# EAGLE design TeensyLinduinoShield (EAGLE 7.7.0)
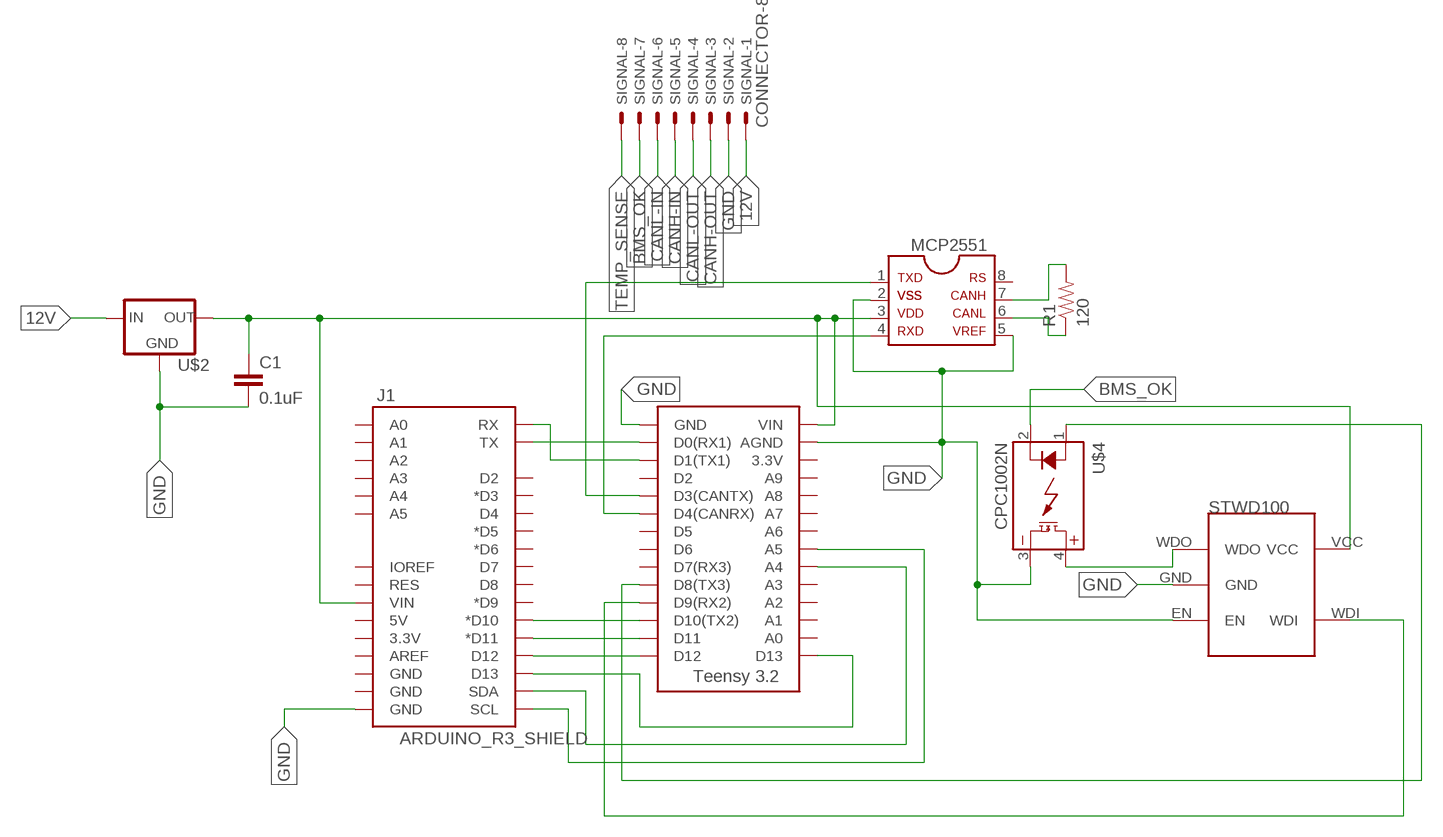
[diagram p0: schematic, sheet 1]

## Parts
C1  0.1uF  CAP0805  [0805]
J1  ARDUINO_R3_SHIELD  [UNO_R3_SHIELD]
MCP2551  MCP2551  [SOIC-08]
R1  120  RESISTOR0805-RES  [0805]
SIGNAL  CONNECTOR-8  [MINIFIT_5566-8]
U$1  TEENSY_3.2_SIMPLE  [TEENSY_3.2_SIMPLE]
U$2  5VREG_LM340-NLM340MPX-5.0/NOPB  [SOT223]
U$3  STWD100  [SOT23-5]
U$4  CPC1002N  [SOP04]

## Nets
12V: SIGNAL.1 U$2.1(IN)
BMS_OK: SIGNAL.7 U$4.2(CONTROL-)
CANH-IN: SIGNAL.5
CANH-OUT: SIGNAL.3
CANL: MCP2551.6 R1.1
CANL-IN: SIGNAL.6
CANL-OUT: SIGNAL.4
GND: C1.2 J1.GND@0(GND) MCP2551.2 MCP2551.5 SIGNAL.2 U$1.AGND U$1.GND U$2.2(GND) U$2.4(GND) U$3.EN U$3.GND U$4.3(DC-)
N$1: J1.TX U$1.D0(RX1)
N$2: J1.RX U$1.D1(TX1)
N$3: J1.D10(*D10) U$1.D10(TX2)
N$4: J1.D11(*D11) U$1.D11
N$5: C1.1 J1.VIN MCP2551.3 U$1.VIN U$2.3(OUT) U$3.VCC
N$6: J1.D12 U$1.D12
N$7: J1.D13 U$1.D13
N$8: MCP2551.1 U$1.D3(CANTX)
N$9: MCP2551.4 U$1.D4(CANRX)
N$10: J1.SCL U$1.A5
N$11: J1.SDA U$1.A4
N$12: U$1.D9(RX2) U$3.WDI
N$13: U$3.WDO U$4.4(DC+)
N$14: MCP2551.7 R1.2
N$16: U$1.D8(TX3) U$4.1(CONTROL+)
TEMP_SENSE: SIGNAL.8
Unconnected: J1.3.3V J1.5V J1.A0 J1.A1 J1.A2 J1.A3 J1.A4 J1.A5 J1.AREF J1.D2 J1.D3(*D3) J1.D4 J1.D5(*D5) J1.D6(*D6) J1.D7 J1.D8 J1.D9(*D9) J1.GND@1(GND) J1.GND@2(GND) J1.IOREF J1.RES MCP2551.8 U$1.3.3V U$1.A0 U$1.A1 U$1.A2 U$1.A3 U$1.A6 U$1.A7 U$1.A8 U$1.A9 U$1.D2 U$1.D5 U$1.D6 U$1.D7(RX3)

## Library data of the parts
C1 = HyTechDevices:CAP: Capacitor Standard 0603 ceramic capacitor, and 0.1" leaded capacitor.
J1 = HyTechDevices:ARDUINO_R3_SHIELD: Shield form compatible with the Arduino Uno R3. Source: Sparkfun <https://github.com/sparkfun/SparkFun-Eagle-Libraries>
MCP2551 = HyTechDevices:MCP2551: MCP2551 High-Speed CAN Transceiver Product Webpage <https://www.microchip.com/wwwproducts/en/MCP2551> Datasheet <http://ww1.microchip.com/downloads/en/DeviceDoc/21667f.pdf> This device is outdated It is replaced by MCP2561. Comparison Page <https://www.microchip.com/wwwproducts/ProductCompare/MCP2551/MCP2561> Product Webpage <https://www.microchip.com/wwwproducts/en/MCP2561> Datasheet <http://ww1.microchip.com/downloads/en/DeviceDoc/20005167C.pdf>
R1 = HyTechDevices:RESISTOR: Resistor Basic schematic elements and footprints for 0603, 1206, and PTH resistors.
SIGNAL = HyTechDevices:CONNECTOR-8: Mini-Fit Junior connector 8 pole Source: http://www.molex.com; OC_FARNELL: unknown; OC_NEWARK: unknown
U$1 = HyTechDevices:TEENSY_3.2_SIMPLE: Simple version of the Teensy 3.2 board that only uses the 2 main rows of pins, not the inner pins or the pins opposite the usb port.
U$2 = HyTechDevices:5VREG_LM340-N: Voltage Regulator 5v linear voltage regulator Datasheet <http://www.mouser.com/ProductDetail/Texas-Instruments/LM340MPX-50-NOPB/?qs=X1J7HmVL2ZGZwtTFRQ9ItA%3D%3D> MAX current out: 1.5A MAX voltage in: 35V
U$3 = HyTechDevices:STWD100: STWD100 Watchdog timer
U$4 = HyTechDevices:CPC1002N: IXYS Solid State Relay .7A

## Board
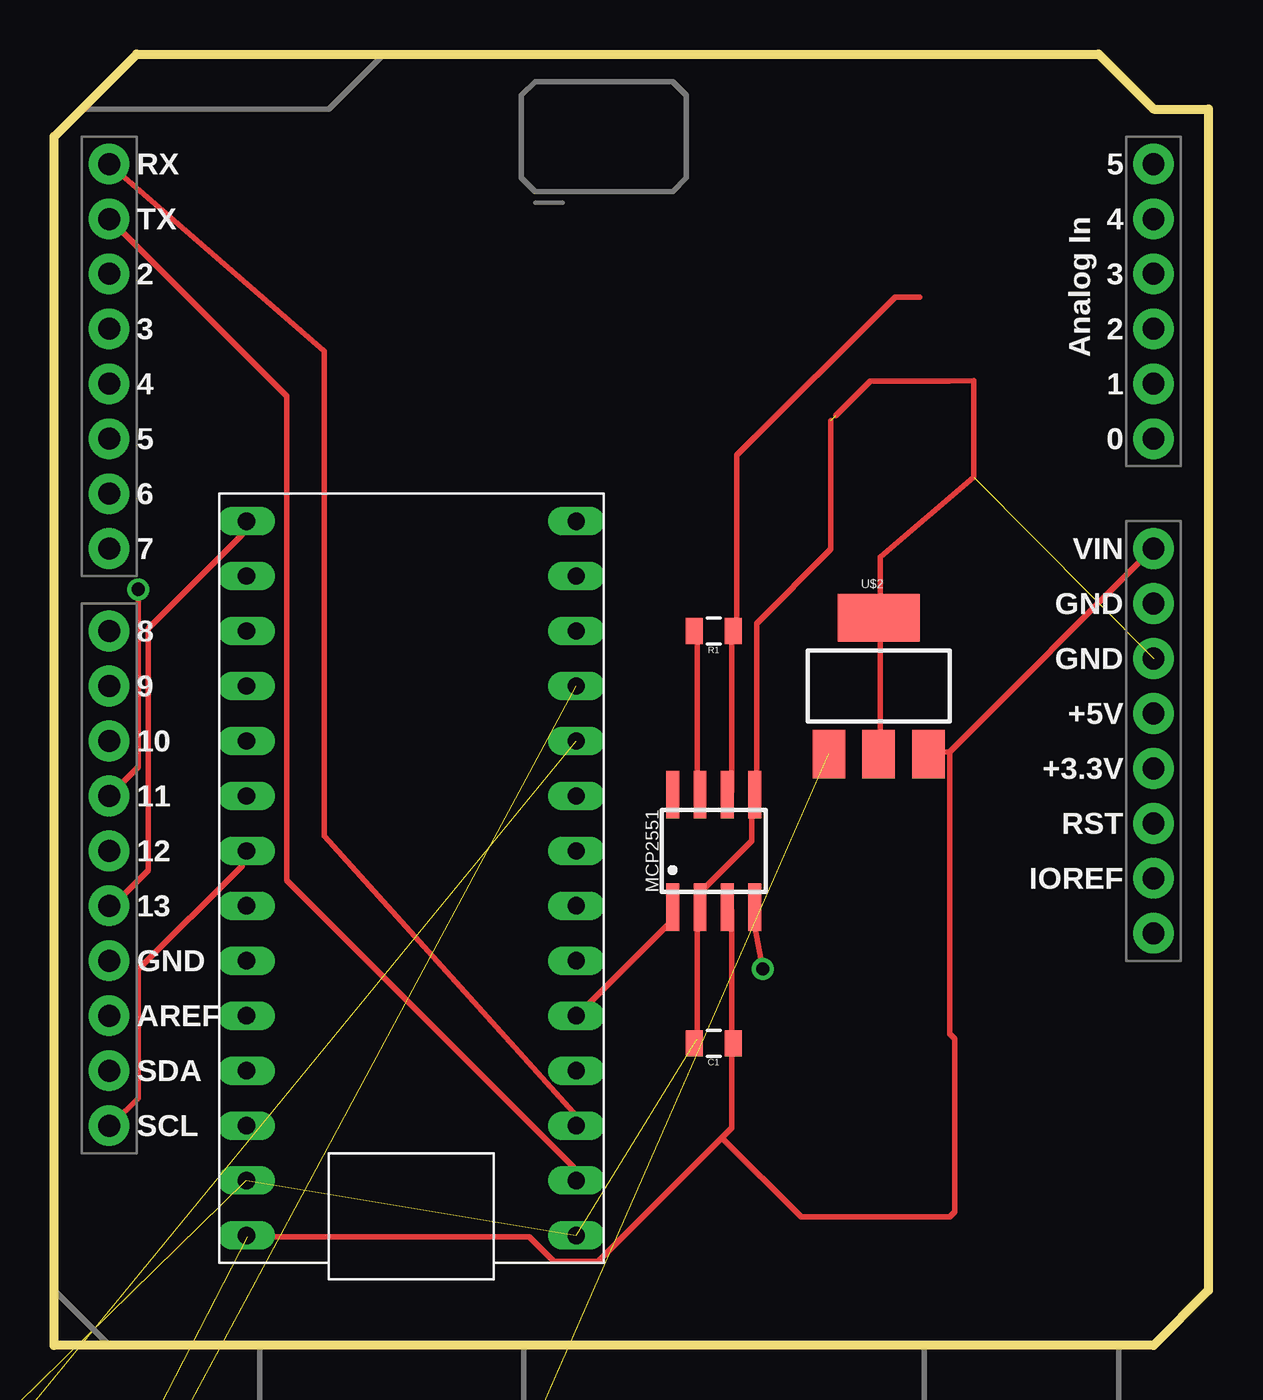
[diagram p1: board, top side]
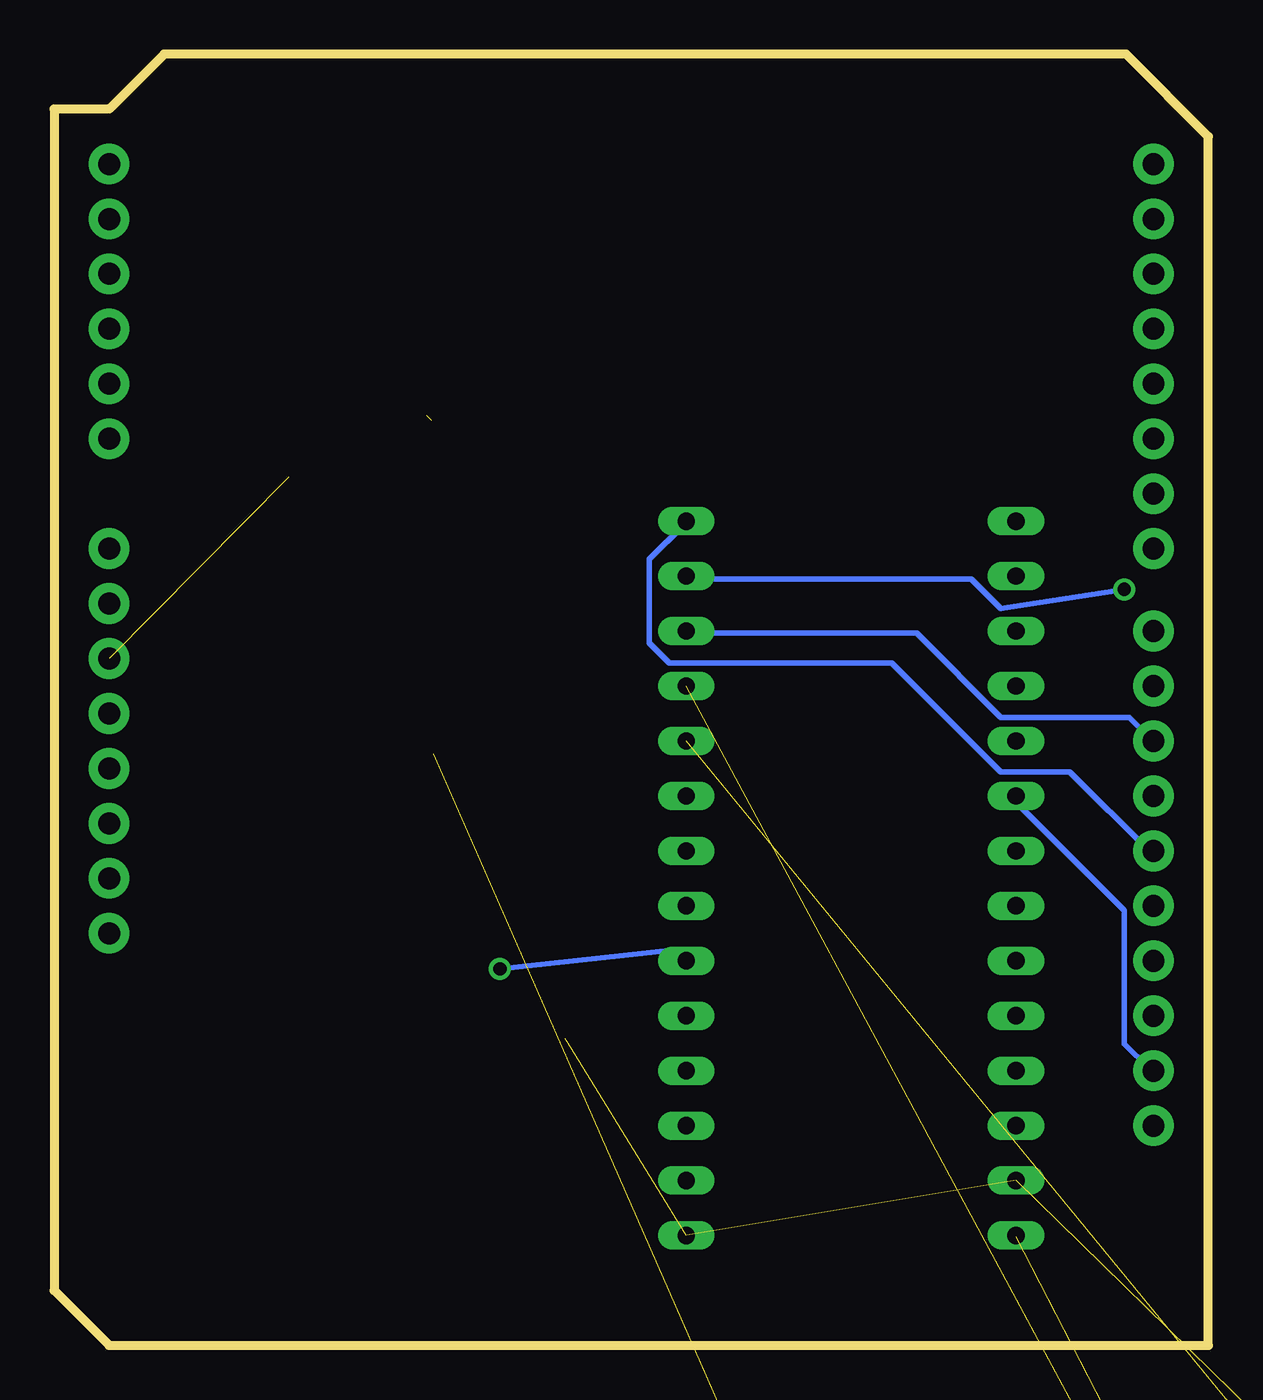
[diagram p2: board, bottom side, seen from below]

Size 53.34 x 59.69 mm. Coordinates in mm from the lower left corner, seen from the top.
Outline: 0,0 0,55.88 3.81,59.69 48.26,59.69 50.8,57.15 53.34,57.15 53.34,2.54 50.8,0 0,0
Copper layers (1*16): Top 0.035mm / dielectric 1.5mm / Bottom 0.035mm
Design rules "default": minimum track width 10mil, minimum drill 24mil, track to track 8mil, track to pad 8mil, pad to pad 8mil, via to via 8mil, smd to smd 8mil, copper to edge 40mil, drill to drill 8mil, minimum pad ring 10mil, minimum via ring 8mil, stop-mask expansion 4mil, vias tented up to drill 0mil, thermal gap 10mil

### Footprints (pad centres in the part's own frame; a part is rotated, then mirrored left to right if it is on the bottom)
0805 = smd 0.8 x 1.2: 1 -0.9,0; 2 0.9,0
UNO_R3_SHIELD = drill 1.016 pad 1.88: 3.3V 50.8,26.67; 5V 50.8,29.21; A0 50.8,41.91; A1 50.8,44.45; A2 50.8,46.99; A3 50.8,49.53; A4 50.8,52.07; A5 50.8,54.61; AREF 2.54,15.24; D2 2.54,49.53; D3 2.54,46.99; D4 2.54,44.45; D5 2.54,41.91; D6 2.54,39.37; D7 2.54,36.83; D8 2.54,33.02; D9 2.54,30.48; D10 2.54,27.94; D11 2.54,25.4; D12 2.54,22.86; D13 2.54,20.32; GND@0 50.8,31.75; GND@1 50.8,34.29; GND@2 2.54,17.78; IOREF 50.8,21.59; NC 50.8,19.05; RES 50.8,24.13; RX 2.54,54.61; SCL 2.54,10.16; SDA 2.54,12.7; TX 2.54,52.07; VIN 50.8,36.83
SOIC-08 = smd 0.6 x 2.2: 1 -1.905,-2.6; 2 -0.635,-2.6; 3 0.635,-2.6; 4 1.905,-2.6; 5 1.905,2.6; 6 0.635,2.6; 7 -0.635,2.6; 8 -1.905,2.6
MINIFIT_5566-8 = drill 1.4 square: 1 6.3,-2.75; 2 2.1,-2.75; 3 -2.1,-2.75; 4 -6.3,-2.75; 5 6.3,2.75; 6 2.1,2.75; 7 -2.1,2.75; 8 -6.3,2.75
TEENSY_3.2_SIMPLE = drill 0.8 long: 3.3V 16.51,29.21; A0 16.51,3.81; A1 16.51,6.35; A2 16.51,8.89; A3 16.51,11.43; A4 16.51,13.97; A5 16.51,16.51; A6 16.51,19.05; A7 16.51,21.59; A8 16.51,24.13; A9 16.51,26.67; AGND 16.51,31.75; D0(RX1) 1.27,31.75; D1(TX1) 1.27,29.21; D2 1.27,26.67; D3(CANTX) 1.27,24.13; D4(CANRX) 1.27,21.59; D5 1.27,19.05; D6 1.27,16.51; D7(RX3) 1.27,13.97; D8(TX3) 1.27,11.43; D9(RX2) 1.27,8.89; D10(TX2) 1.27,6.35; D11 1.27,3.81; D12 1.27,1.27; D13 16.51,1.27; GND 1.27,34.29; VIN 16.51,34.29
SOT223 = smd 1.5 x 2.235: 1 -2.3,-3.15; 2 0,-3.15; 3 2.3,-3.15 | smd 3.8 x 2.2: 4 0,3.15
SOT23-5 = smd 0.61 x 0.406: EN -2.794,0; GND -2.794,0.94; VCC 0,1.905; WDI 0,0; WDO -2.794,1.905
SOP04 = smd 0.8 x 1.2: 1 -1.27,-3; 2 1.27,-3; 3 1.27,3; 4 -1.27,3

### Placement (x,y rotation side)
C1  30.48,13.97 180 top
J1  0,0 0 top
MCP2551  30.48,22.86 0 top
R1  30.48,33.02 180 top
SIGNAL  1.27,-34.29 0 top  (outside the outline)
U$1  25.4,39.37 180 top
U$2  38.1,30.48 0 top
U$3  -2.54,-19.05 0 top  (outside the outline)
U$4  -11.43,-13.97 0 top  (outside the outline)

### Tracks (layer width: path | path; a pad name or v marks a point on that pad's centre or on a via)
12V  (1 unrouted)
BMS_OK  (1 unrouted)
CANL
  Top 0.254: MCP2551.6 31.32,25.6 31.32,32.92 R1.1 31.55,33.15 31.55,41.15 38.86,48.46 40.01,48.46
GND  (9 unrouted)
  Top 0.254: U$2.2 38.18,27.43 38.18,33.6 U$2.4 38.18,33.83 38.18,36.45 42.49,40.13 42.49,44.6 41.38,44.58 37.72,44.58 36.12,42.98 | 29.72,14.17 29.72,20.12 MCP2551.2 29.95,20.34 29.95,21.03 32.23,23.32 32.23,25.38 MCP2551.5 32.46,25.6 32.46,33.38 35.89,36.8 35.89,42.75
N$1
  Top 0.254: U$1.D0(RX1) 24,7.77 24,8.23 10.74,21.49 10.74,43.89 2.74,51.89 J1.TX
N$2
  Top 0.254: J1.RX 12.47,45.95 12.47,23.55 24,10.74 24,10.29 U$1.D1(TX1)
N$3
  Bottom 0.254: U$1.D10(TX2) 24,32.92 13.49,32.92 9.6,29.03 3.66,29.03 2.74,28.12 J1.D10
N$4  (via drill 0.61)
  Top 0.254: v3.89,34.95 3.89,26.75 J1.D11
  Bottom 0.254: v3.89,34.95 9.6,34.06 10.97,35.43 24,35.43 U$1.D11
N$5  (1 unrouted)
  Top 0.254: 41.38,27.43 40.46,27.43 U$2.3 | 41.38,27.43 50.75,36.8 J1.VIN | MCP2551.3 31.32,20.12 31.32,14.17 C1.1 31.32,13.95 31.32,10.06 30.86,9.6 | 30.86,9.6 25.15,3.89 23.09,3.89 21.95,5.03 8.91,5.03 U$1.VIN | 41.38,27.43 41.38,14.4 41.6,14.17 41.6,6.17 41.38,5.94 34.52,5.94 30.86,9.6
N$6
  Bottom 0.254: U$1.D12 24.23,37.95 25.83,36.35 25.83,32.46 24.92,31.55 14.63,31.55 9.6,26.52 6.4,26.52 2.74,22.86 J1.D12
N$7
  Top 0.254: U$1.D13 8.69,37.95 8.69,37.49 4.34,33.15 4.34,21.95 2.74,20.34 J1.D13
N$8
  Top 0.254: MCP2551.1 28.57,19.66 24.23,15.32 U$1.D3(CANTX)
N$9  (via drill 0.61)
  Top 0.254: v32.74,17.4 32.23,20.12 MCP2551.4
  Bottom 0.254: v32.74,17.4 24.69,18.29 24.23,17.83 U$1.D4(CANRX)
N$10
  Top 0.254: U$1.A5 8.69,22.86 8.69,22.17 3.89,17.37 3.89,11.43 2.74,10.29 J1.SCL
N$11
  Bottom 0.254: U$1.A4 8.69,25.38 8.69,24.92 3.89,20.12 3.89,13.95 2.74,12.8 J1.SDA
N$12  (1 unrouted)
N$13  (1 unrouted)
N$14
  Top 0.254: R1.2 29.72,32.92 29.72,25.6 MCP2551.7
N$16  (1 unrouted)